# EasyEDA Pro project ProPrj_辉光管_2024.2.16_2024-11-09.epro, board PCB11
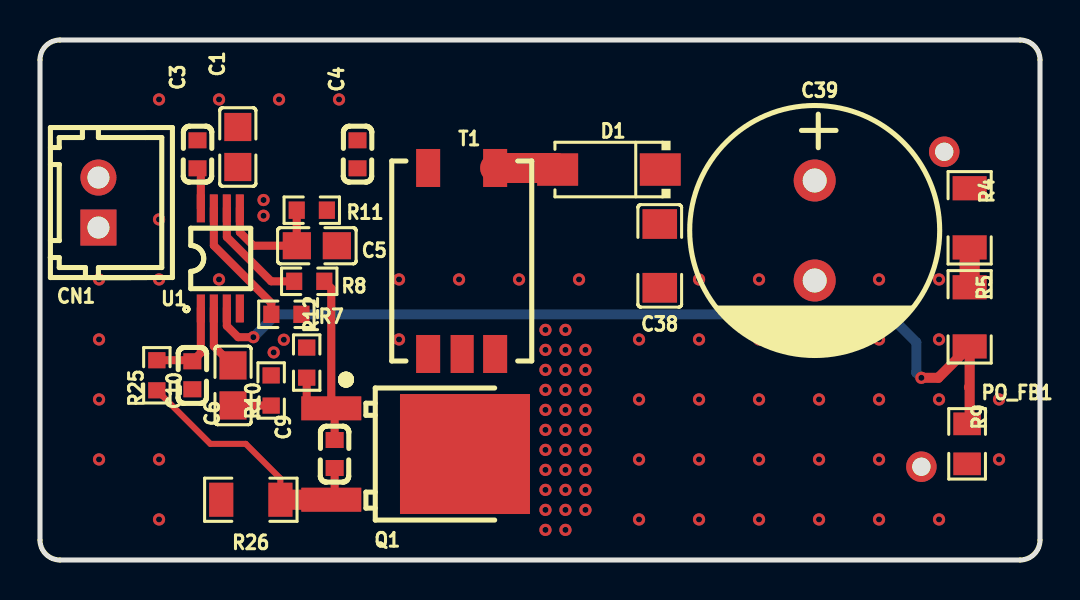
[diagram p4: board, top side]
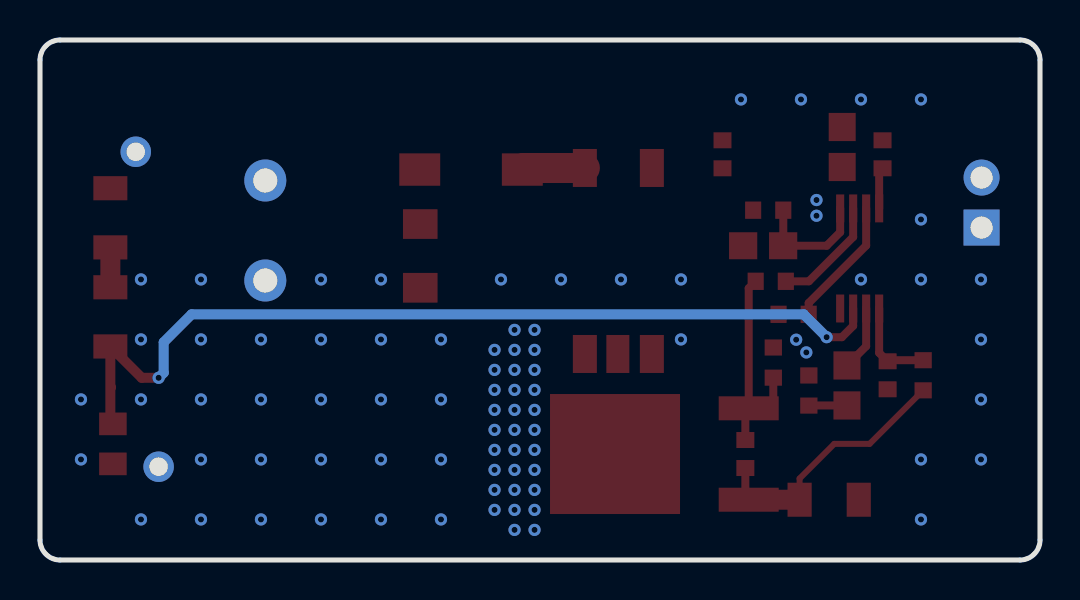
[diagram p5: board, bottom side, seen from below]

Outline 50 x 26 mm; copper layers: Top Layer, Bottom Layer. Coordinates in mm from the lower left corner of the outline.
Outline path: 0,25 0,1 arc(0.29,0.29) 1,0 49,0 arc(49.71,0.29) 50,1 50,25 arc(49.71,25.71) 49,26 1,26 arc(0.29,25.71) 0,25
Stack: Top Layer 0.035mm / Dielectric1 1.51mm FR4 er 4.5 / Bottom Layer 0.035mm

## Design rules (mm)
template: 自定义配置
spacing copperThickness1oz (default): track to track 0.102, other pairs 0.152 to 0.3
spacing copperThickness2oz: track to track 0.203, other pairs 0.152 to 0.3
track width copperThickness1oz (default): min 0.127, default 0.254, max 2.54
track width copperThickness2oz: min 0.203, default 0.254, max 2.54
differential pair differentialPair (default): width min 0.127, default 0.254, max 2.54; gap min 0.152, default 0.152
via viaSize (default): diameter min 0.5, default 0.61, max 10; hole min 0.3, default 0.305, max 6.3

## Placement (name value [footprint] x y rotation side)
C1  10uF  [C0805]  9.89 20.65 270 top
C3  100nF  [C0603]  7.87 20.28 270 top
C4  100nF  [C0603]  15.88 20.28 270 top
C5  10uF  [C0805]  13.84 15.71 180 top
C6  10uF  [C0805]  9.65 8.73 90 top
C9  1nF  [C0603]  14.73 5.3 90 top
C10  100nF  [C0603]  7.62 9.24 90 top
C38  100nF  [C1206]  30.99 15.2 90 top
C39  47uF  [CAP-TH_BD12.5-P5.00-D0.6-FD]  38.74 16.47 270 top
CN1  ZX-XH2.54-2PZZ  [CONN-TH_2P-P2.50_HX25003-2A]  2.92 17.87 90 top
D1  ES1J  [SMA_L4.4-W2.8-LS5.4-RD]  28.45 19.52 180 top
NOREF  -  [Pad_e28]  44.07 4.66 0 top
NOREF#2  -  [Pad_e26]  45.21 20.41 0 top
PO_FB1  -  [Test-Point-0.5mm]  46.45 8.64 0 top
Q1  NCEP02515K  [TO-252-3_L6.6-W6.1-P4.58-LS10.1-BR-2]  17.91 5.3 180 top
R4  100kΩ  [R1206]  46.48 17.11 270 top
R5  100kΩ  [R1206]  46.48 12.16 270 top
R7  100kΩ  [R0603]  12.32 12.28 180 top
R8  10Ω  [R0603]  13.46 13.94 0 top
R9  1.5kΩ  [R0805]  46.35 5.81 90 top
R10  10kΩ  [R0603]  11.56 8.47 270 top
R11  20Ω  [R0603]  13.59 17.49 180 top
R12  10kΩ  [R0603]  13.34 9.87 270 top
R25  20Ω  [R0603]  5.84 9.24 270 top
R26  100mΩ  [R1206]  10.54 3.01 0 top
T1  TTRN-060S-013-T  [TTRN-060S-013]  21.08 14.95 0 top
U1  -  [MSOP-8_L3.0-W3.0-P0.65-LS4.9-TL]  9.02 15.08 90 top

## Footprints (pads in the part's own frame, mm; a bottom-side part is the same pattern mirrored in y, then rotated)
C0603
  rect 0.8x0.9 smd: 1(-0.7,0) 2(0.7,0)
C0805
  rect 1.41x1.35 smd: 1(-1,0) 2(1,0)
C1206
  rect 1.485x1.728 smd: 1(-1.593,0) 2(1.593,0)
CAP-TH_BD12.5-P5.00-D0.6-FD
  round 2.1 hole 1.2: 1(-2.5,0) 2(2.5,0)
CONN-TH_2P-P2.50_HX25003-2A
  rect 1.8x1.8 hole 1.1: 1(-1.25,0)
  round 1.8 hole 1.1: 2(1.25,0)
MSOP-8_L3.0-W3.0-P0.65-LS4.9-TL
  rect 1.397x0.406 smd: 1(-2.502,0.975) 2(-2.502,0.325) 3(-2.502,-0.325) 4(-2.502,-0.975) 5(2.502,-0.975) 6(2.502,-0.325) 7(2.502,0.325) 8(2.502,0.975)
Pad_e26
  round 1.524 hole 0.914: 9(0,0)
Pad_e28
  round 1.524 hole 0.914: 10(0,0)
R0603
  rect 0.806x0.864 smd: 1(-0.753,0) 2(0.753,0)
R0805
  rect 1.133x1.377 smd: 1(-1,0) 2(1,0)
R1206
  rect 1.208x1.701 smd: 1(-1.479,0) 2(1.479,0)
SMA_L4.4-W2.8-LS5.4-RD
  rect 2.046x1.62 smd: 1(-2.566,0) 2(2.566,0)
Test-Point-0.5mm
  round 0.5 smd: 1(0,0)
TO-252-3_L6.6-W6.1-P4.58-LS10.1-BR-2
  rect 3x1.2 smd: 1(3.342,-2.285) 3(3.342,2.285)
  rect 6.5x6 smd: 2(-3.342,0)
TTRN-060S-013
  rect 1.2x1.9 smd: 1(-1.675,4.65) 2(1.675,4.651) 3(-1.675,-4.65) 5(1.675,-4.651)
  rect 1.15x1.9 smd: EMPTY(0.025,-4.65)

## Nets
GND: C1.1 C3.1 C4.1 C5.1 C10.1 C38.1 C39.2 CN1.1 NOREF.10 R7.1 R9.1 R10.1 R11.1 R12.1 R26.1 T1.3 U1.4
VIN: C1.2 C3.2 C4.2 CN1.2 T1.1 U1.8
DR: R8.1 U1.6
FB: PO_FB1.1 R5.2 R9.2 U1.3
HV: C38.2 C39.1 D1.1 NOREF#2.9 R4.1
ISEN: C10.2 R25.1 U1.1
$1N991: R7.2 U1.7
$1N997: C5.2 R11.2 U1.5
$1N1005: C6.1 R10.2
$1N1007: C6.2 U1.2
$1N1020: C9.2 Q1.1 R8.2 R12.2
$1N1033: C9.1 Q1.3 R25.2 R26.2
$1N1040: D1.2 T1.2
$1N1047: R4.2 R5.1
$1N1060: Q1.2 T1.5

Pads without a net: T1 EMPTY

## Via types
v1: diameter 0.61, hole 0.305, Top Layer to Bottom Layer, 37 vias
v2: diameter 0.61, hole 0.304, Top Layer to Bottom Layer, 47 vias

## Routing (per net, layer and track width the routed paths; a pad name or vN(x,y) marks a point on that pad's centre or on a via; arc(x,y) is an arc through that point)
GND:
  vias: v1(11.18,18) v1(11.18,17.21) v1(11.68,10.38) v1(12.19,11.01) v2(2.95,14.03) v2(2.95,11.03) v2(2.95,8.03) v2(2.95,5.03) v2(5.95,23.03) v2(5.95,17.03) v2(5.95,14.03) v2(5.95,5.03) v2(5.95,2.03) v2(8.95,23.03) v2(8.95,14.03) v2(11.95,23.03) v2(14.95,23.03) v2(17.95,14.03) v2(17.95,11.03) v2(20.95,14.03) v2(23.95,14.03) v2(26.95,14.03) v2(29.95,11.03) v2(29.95,8.03) v2(29.95,5.03) v2(29.95,2.03) v2(32.95,14.03) v2(32.95,11.03) v2(32.95,8.03) v2(32.95,5.03) v2(32.95,2.03) v2(35.95,14.03) v2(35.95,11.03) v2(35.95,8.03) v2(35.95,5.03) v2(35.95,2.03) v2(38.95,11.03) v2(38.95,8.03) v2(38.95,5.03) v2(38.95,2.03) v2(41.95,14.03) v2(41.95,11.03) v2(41.95,8.03) v2(41.95,5.03) v2(41.95,2.03) v2(44.95,14.03) v2(44.95,11.03) v2(44.95,8.03) v2(44.95,2.03) v2(47.95,8.03) v2(47.95,5.03)
VIN: length 2.1
  Top Layer w0.4: C3.2 8.04,19.42 U1.8
DR: length 5.7
  Top Layer w0.4: R8.1 11.56,13.94 9.34,16.15 U1.6
FB: length 45.5
  Top Layer w0.4: U1.3 9.34,11.7 9.91,11.14 v1(10.67,11.14)
  Top Layer w0.5: v1(44.07,9.11) 44.91,9.11 R5.2 46.48,6.93 R9.2
  Bottom Layer w0.5: v1(44.07,9.11) 43.81,9.36 43.81,10.89 42.42,12.28 11.81,12.28 v1(10.67,11.14)
ISEN: length 4.6
  Top Layer w0.4: R25.1 7.57,9.99 C10.2 8.04,10.36 U1.1
$1N991: length 6.5
  Top Layer w0.4: R7.2 11.57,12.85 8.69,15.72 U1.7
$1N997: length 6.1
  Top Layer w0.4: R11.2 12.84,15.72 C5.2 10.67,15.71 9.99,16.39 U1.5
$1N1005: length 1.9
  Top Layer w0.4: C6.1 11.55,7.73 R10.2
$1N1007: length 3.2
  Top Layer w0.4: C6.2 8.69,10.69 U1.2
$1N1020: length 10.8
  Top Layer w0.4: R8.2 14.56,13.59 Q1.1 14.33,7.58 ; 14.33,7.58 13.72,7.58 13.34,7.97 R12.2 ; 14.33,7.58 14.73,7.18 C9.2
$1N1033: length 13.3
  Top Layer w0.3: R25.2 8.52,5.81 10.29,5.81 12.02,4.07 R26.2
  Top Layer w0.4: C9.1 14.73,3.18 Q1.3
  Top Layer w1: R26.2 14.56,3.01
$1N1040: length 3.2
  Top Layer w1.5: T1.2 25.8,19.6 D1.2
$1N1047: length 2
  Top Layer w1: R4.2 R5.1
$1N1060:
  vias: v1(25.27,11.51) v1(25.27,10.51) v1(25.27,9.51) v1(25.27,8.51) v1(25.27,7.51) v1(25.27,6.51) v1(25.27,5.51) v1(25.27,4.51) v1(25.27,3.51) v1(25.27,2.51) v1(25.27,1.51) v1(26.27,11.51) v1(26.27,10.51) v1(26.27,9.51) v1(26.27,8.51) v1(26.27,7.51) v1(26.27,6.51) v1(26.27,5.51) v1(26.27,4.51) v1(26.27,3.51) v1(26.27,2.51) v1(26.27,1.51) v1(27.27,10.51) v1(27.27,9.51) v1(27.27,8.51) v1(27.27,7.51) v1(27.27,6.51) v1(27.27,5.51) v1(27.27,4.51) v1(27.27,3.51) v1(27.27,2.51)

## Copper pours and planes (outline as drawn; the poured copper is in the pictures)
GND on Top Layer: -0.38,28.03 -3.05,25.36 -3.05,-3.84 -2.92,-3.97 52.71,-3.97 56.39,-0.29 56.39,15.08 20.32,15.08 16.76,18.63 16.76,24.35 15.24,25.87 15.24,28.29 14.99,28.03
GND on Bottom Layer: -0.38,28.03 -3.05,25.36 -3.05,-3.84 -2.92,-3.97 52.71,-3.97 56.39,-0.29 56.39,15.08 20.32,15.08 16.76,18.63 16.76,24.35 15.24,25.87 15.24,28.29 14.99,28.03
VIN on Top Layer: 2.41,20.41 1.65,19.65 1.65,18.51 2.29,17.87 6.48,17.87 7.11,18.51 19.94,18.51 20.32,18.89 20.32,20.41 19.94,20.79 17.4,20.79 17.02,20.41
HV on Top Layer: 30.48,21.56 29.79,20.86 29.79,16.45 30.1,16.13 32.04,16.13 33.78,17.87 48.26,17.87 48.64,18.25 48.64,19.02 46.18,21.48 31.57,21.48 31.5,21.56
$1N1060 on Top Layer: 22.73,12.16 21.97,11.39 21.97,9.36 21.21,8.6 18.11,8.6 17.53,8.01 17.53,1.62 18.29,0.85 26.92,0.85 27.94,1.87 27.94,11.39 27.18,12.16
$1N1060 on Bottom Layer: 22.73,12.16 21.97,11.39 21.97,9.36 21.21,8.6 18.11,8.6 17.53,8.01 17.53,1.62 18.29,0.85 26.92,0.85 27.94,1.87 27.94,11.39 27.18,12.16
